# Altium project Task_2.PrjPcb (part 1 of 5)
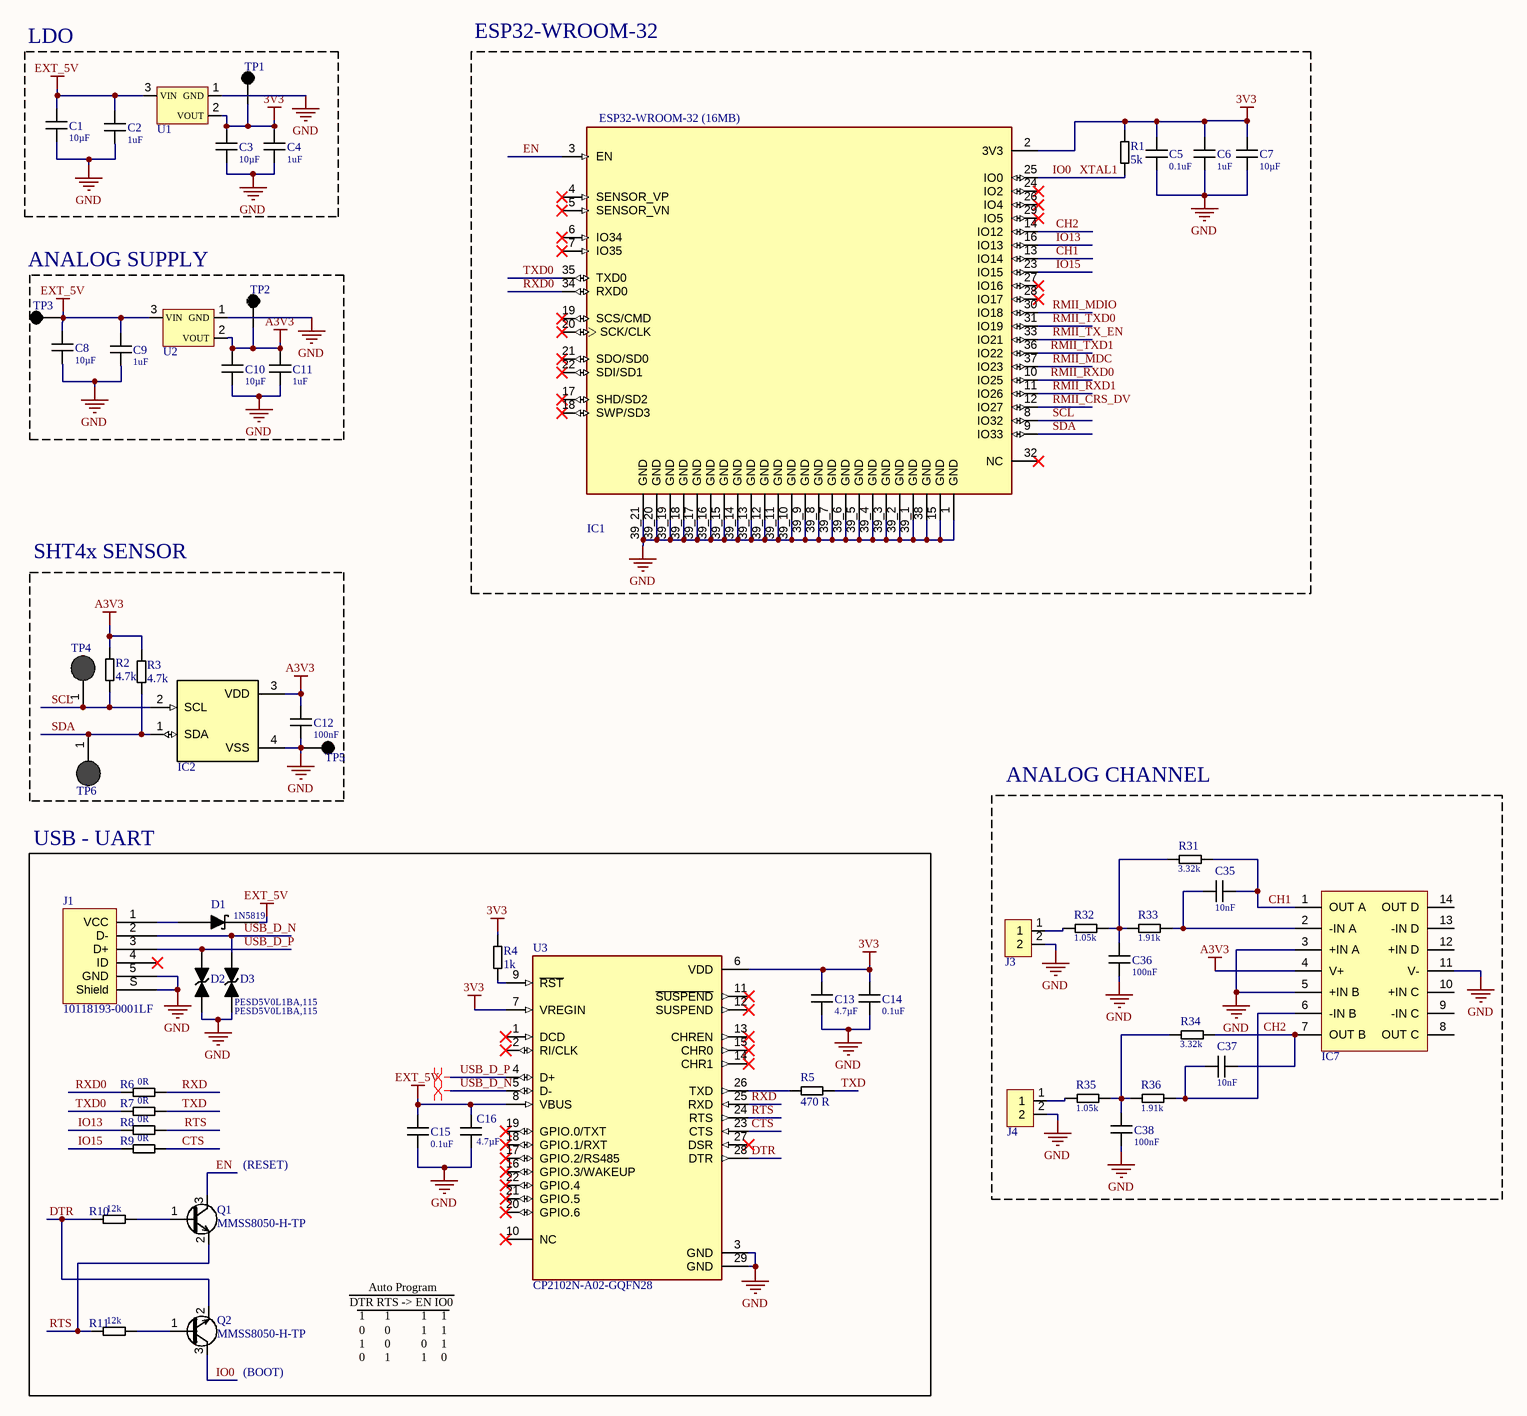
[diagram p0: Sheet1.SchDoc]
2 sheets, 104 parts. Net scope: global (net labels, ports and power ports of the same name join across sheets).
Board file: PCB1.PcbDoc
Sheets:
  Sheet1.SchDoc
  ethernet.SchDoc

## Sheet Sheet1.SchDoc
size 420 x 297 mm; SheetNumber: 1; SheetTotal: 2

### Parts
C1  Capacitance: 10µF  [CAP_0603]  (hidden comment: CC0603KRX5R6BB106)
C2  Capacitance: 1uF  [CAP_0603]  (hidden comment: CC0603KRX5R6BB105)
C3  Capacitance: 10µF  [CAP_0603]  (hidden comment: CC0603KRX5R6BB106)
C4  Capacitance: 1uF  [CAP_0603]  (hidden comment: CC0603KRX5R6BB105)
C5  Capacitance: 0.1uF  [CAP_0603]  (hidden comment: C0603C104K8RACTU)
C6  Capacitance: 1uF  [CAP_0603]  (hidden comment: CC0603KRX5R6BB105)
C7  Capacitance: 10µF  [CAP_0603]  (hidden comment: CC0603KRX5R6BB106)
C8  Capacitance: 10µF  [CAP_0603]  (hidden comment: CC0603KRX5R6BB106)
C9  Capacitance: 1uF  [CAP_0603]  (hidden comment: CC0603KRX5R6BB105)
C10  Capacitance: 10µF  [CAP_0603]  (hidden comment: CC0603KRX5R6BB106)
C11  Capacitance: 1uF  [CAP_0603]  (hidden comment: CC0603KRX5R6BB105)
C12  Capacitance: 100nF  [CAP_0603]  (hidden comment: C0603C104M5RAC7867)
C13  Capacitance: 4.7µF  [CAP_0603]  (hidden comment: CL21A475KAQNNNE)
C14  Capacitance: 0.1uF  [CAP_0603]  (hidden comment: C0603C104K8RACTU)
C15  Capacitance: 0.1uF  [CAP_0603]  (hidden comment: C0603C104K8RACTU)
C16  Capacitance: 4.7µF  [CAP_0603]  (hidden comment: CL21A475KAQNNNE)
C35  Capacitance: 10nF  [CAP_0603]  (hidden comment: 0603B103K160CT)
C36  Capacitance: 100nF  [CAP_0603]  (hidden comment: C0603C104M5RAC7867)
C37  Capacitance: 10nF  [CAP_0603]  (hidden comment: 0603B103K160CT)
C38  Capacitance: 100nF  [CAP_0603]  (hidden comment: C0603C104M5RAC7867)
D1  1N5819  [SOD323F]
D2  PESD5V0L1BA,115  [DIO_BZX384-C30,115]
D3  PESD5V0L1BA,115  [DIO_BZX384-C30,115]
IC1  ESP32-WROOM-32 (16MB)  [ESP32-WROOM-32]
IC2  SHT40-BD1B-R2  [SHT40-BD1B-R2]  (value not drawn)
IC7  OPA4187IPWR  [SOP65P640X120-14N]  (value not drawn)
J1  10118193-0001LF  [FCI USB 10118193-0001LF]
J3  691137710002  [T-BLOCK 2POS]  (value not drawn)
J4  691137710002  [T-BLOCK 2POS]  (value not drawn)
Q1  MMSS8050-H-TP  [SOT23]
Q2  MMSS8050-H-TP  [SOT23]
R1  value 5k  [RES_0603]  (hidden comment: RT0603BRE075KL)
R2  Resistance: 4.7k  [RES_0805]  (hidden comment: CRCW08054K70FKEAC)
R3  Resistance: 4.7k  [RES_0805]  (hidden comment: CRCW08054K70FKEAC)
R4  value 1k  [RES_0603]  (hidden comment: RC0603FR-071KL)
R5  Resistance: 470 R  [RES_0603]  (hidden comment: RC0603FR-10470RL)
R6  Resistance: 0R  [RES_0603]  (hidden comment: RC0603JR-070RL)
R7  Resistance: 0R  [RES_0603]  (hidden comment: RC0603JR-070RL)
R8  Resistance: 0R  [RES_0603]  (hidden comment: RC0603JR-070RL)
R9  Resistance: 0R  [RES_0603]  (hidden comment: RC0603JR-070RL)
R10  value 12k  [RES_0603]  (hidden comment: RC0603JR-0712KL)
R11  value 12k  [RES_0603]  (hidden comment: RC0603JR-0712KL)
R31  Resistance: 3.32k  [RES_0603]  (hidden comment: ERA-3AEB3321V)
R32  Resistance: 1.05k  [RES_0603]  (hidden comment: ERA-3AEB1051V)
R33  Resistance: 1.91k  [RES_0603]  (hidden comment: ERA-3AEB1911V)
R34  Resistance: 3.32k  [RES_0603]  (hidden comment: ERA-3AEB3321V)
R35  Resistance: 1.05k  [RES_0603]  (hidden comment: ERA-3AEB1051V)
R36  Resistance: 1.91k  [RES_0603]  (hidden comment: ERA-3AEB1911V)
TP1  Test Point  [TP-5007]  (value not drawn)
TP2  Test Point  [TP-5007]  (value not drawn)
TP3  Test Point  [TP-5007]  (value not drawn)
TP4  TEST PAD  [TEST_PAD]  (value not drawn)
TP5  Test Point  [TP-5007]  (value not drawn)
TP6  TEST PAD  [TEST_PAD]  (value not drawn)
U1  AMS1117-3.3V  [SOT223]  (value not drawn)
U2  AMS1117-3.3V  [SOT223]  (value not drawn)
U3  CP2102N-A02-GQFN28  [QFN50P500X500X80-29N]

### Blocks framed on the sheet
LDO: C1-C4 TP1 U1
ESP32-WROOM-32: C5-C7 IC1 R1
ANALOG SUPPLY: C8-C11 TP2 TP3 U2
SHT4x SENSOR: C12 IC2 R2 R3 TP4-TP6
ANALOG CHANNEL: C35-C38 IC7 J3 J4 R31-R36
USB - UART: C13-C16 D1-D3 J1 Q1 Q2 R4-R11 U3

### Nets
3V3: C3.2 C4.2 C5.2 C6.2 C7.2 C13.2 C14.2 IC1.2(3V3) R1.2 R4.2 TP1.TP U1.2(VOUT) U3.6(VDD) U3.7(VREGIN)
A3V3: C10.2 C11.2 C12.2 IC2.3(VDD) IC7.4(V+) R2.2 R3.2 TP2.TP U2.2(VOUT)
EXT_5V: C1.2 C2.2 C8.2 C9.2 C15.2 C16.2 D1.1 TP3.TP U1.3(VIN) U2.3(VIN) U3.8(VBUS)
GND: C1.1 C2.1 C3.1 C4.1 C5.1 C6.1 C7.1 C8.1 C9.1 C10.1 C11.1 C12.1 C13.1 C14.1 C15.1 C16.1 C36.1 C38.1 D2.A D3.A IC1.1(GND) IC1.15(GND) IC1.38(GND) IC1.39_1(GND) IC1.39_2(GND) IC1.39_3(GND) IC1.39_4(GND) IC1.39_5(GND) IC1.39_6(GND) IC1.39_7(GND) IC1.39_8(GND) IC1.39_9(GND) IC1.39_10(GND) IC1.39_11(GND) IC1.39_12(GND) IC1.39_13(GND) IC1.39_14(GND) IC1.39_15(GND) IC1.39_16(GND) IC1.39_17(GND) IC1.39_18(GND) IC1.39_19(GND) IC1.39_20(GND) IC1.39_21(GND) IC2.4(VSS) IC7.3(+IN_A) IC7.5(+IN_B) IC7.11(V-) J1.5(GND) J1.S(Shield) J3.2 J4.2 TP5.TP U1.1(GND) U2.1(GND) U3.3(GND) U3.29(GND)
CH1: C35.2 IC1.13(IO14) IC7.1(OUT_A) R31.2
CH2: C37.2 IC1.14(IO12) IC7.7(OUT_B) R34.2
CTS: R9.2 U3.23(CTS)
DTR: Q2.2(E) R10.1 U3.28(DTR)
EN: IC1.3(EN) Q1.3(C)
IO0: IC1.25(IO0) Q2.3(C) R1.1  [also labelled XTAL1]
IO13: IC1.16(IO13) R8.1
IO15: IC1.23(IO15) R9.1
RMII_CRS_DV: IC1.12(IO27)
RMII_MDC: IC1.37(IO23)
RMII_MDIO: IC1.30(IO18)
RMII_RXD0: IC1.10(IO25)
RMII_RXD1: IC1.11(IO26)
RMII_TX_EN: IC1.33(IO21)
RMII_TXD0: IC1.31(IO19)
RMII_TXD1: IC1.36(IO22)
RTS: Q1.2(E) R8.2 R11.1 U3.24(RTS)
RXD: R6.2 U3.25(RXD)
RXD0: IC1.34(RXD0) R6.1
SCL: IC1.8(IO32) IC2.2(SCL) R2.1 TP4.1
SDA: IC1.9(IO33) IC2.1(SDA) R3.1 TP6.1
TXD: R5.2 R7.2
TXD0: IC1.35(TXD0) R7.1
USB_D_N: D3.K J1.2(D-) U3.5(D-)
USB_D_P: D2.K J1.3(D+) U3.4(D+)
NetC35_1: C35.1 IC7.2(-IN_A) R33.2
NetC36_2: C36.2 R31.1 R32.2 R33.1
NetC37_1: C37.1 IC7.6(-IN_B) R36.2
NetC38_2: C38.2 R34.1 R35.2 R36.1
NetD1_2: D1.2 J1.1(VCC)
NetJ3_1: J3.1 R32.1
NetJ4_1: J4.1 R35.1
NetQ1_1: Q1.1(B) R10.2
NetQ2_1: Q2.1(B) R11.2
NetR4_1: R4.1 U3.9(~{RST})
NetR5_1: R5.1 U3.26(TXD)

Not connected (* = marked no-connect by the designer): IC1 4(SENSOR_VP)* 5(SENSOR_VN)* 6(IO34)* 7(IO35)* 17(SHD/SD2)* 18(SWP/SD3)* 19(SCS/CMD)* 20(SCK/CLK)* 21(SDO/SD0)* 22(SDI/SD1)* 24(IO2)* 26(IO4)* 27(IO16)* 28(IO17)* 29(IO5)* 32(NC)*; IC7 8(OUT_C) 9(-IN_C) 10(+IN_C) 12(+IN_D) 13(-IN_D) 14(OUT_D); J1 4(ID)*; U3 1(DCD)* 2(RI/CLK)* 10(NC)* 11(~{SUSPEND})* 12(SUSPEND)* 13(CHREN)* 14(CHR1)* 15(CHR0)* 16(GPIO.3/WAKEUP)* 17(GPIO.2/RS485)* 18(GPIO.1/RXT)* 19(GPIO.0/TXT)* 20(GPIO.6)* 21(GPIO.5)* 22(GPIO.4)* 27(DSR)*

### Layout directives
differential pair: USB_D_N, USB_D_P

### Notes on the sheet
- (near Q1) (RESET)
- DTR RTS -> EN IO0
- Auto Program
- 1
- 0
- (near Q2) (BOOT)
- THIS DOCUMENT AND THE DATA DISCLOSED HEREIN OR
- HEREWITH IS THE PROPERTY OF ALTIUM LIMITED AND MAY
- DWG NO:
- REVISION
- REV:
- DESCRIPTION
- DATE
- APPROVED
- BE FREELY DISTRIBUTED IN WHOLE. NO RIGHTS ARE
- RESERVED OR EXPRESS OR IMPLIED WARANTEE GIVEN.
- ENG:
- APPROVALS
- PROJECT
- DSN:
- CHK:
- REFERENCE DOCUMENTS
- PROJECT REVISION:
- TITLE
- DOCUMENT REVISION:
- DESIGN ITEM:
- BOM:
- FAB DWG:
- PCB DWG:
- ASSY DWG:
- SCALE:
- A3
- SIZE
- CAGE CODE
- FILE NAME
- DWG NO.
- SHEET
- OF
- REV